# Altium project ArduinoMegaDevBoard.PrjPcb
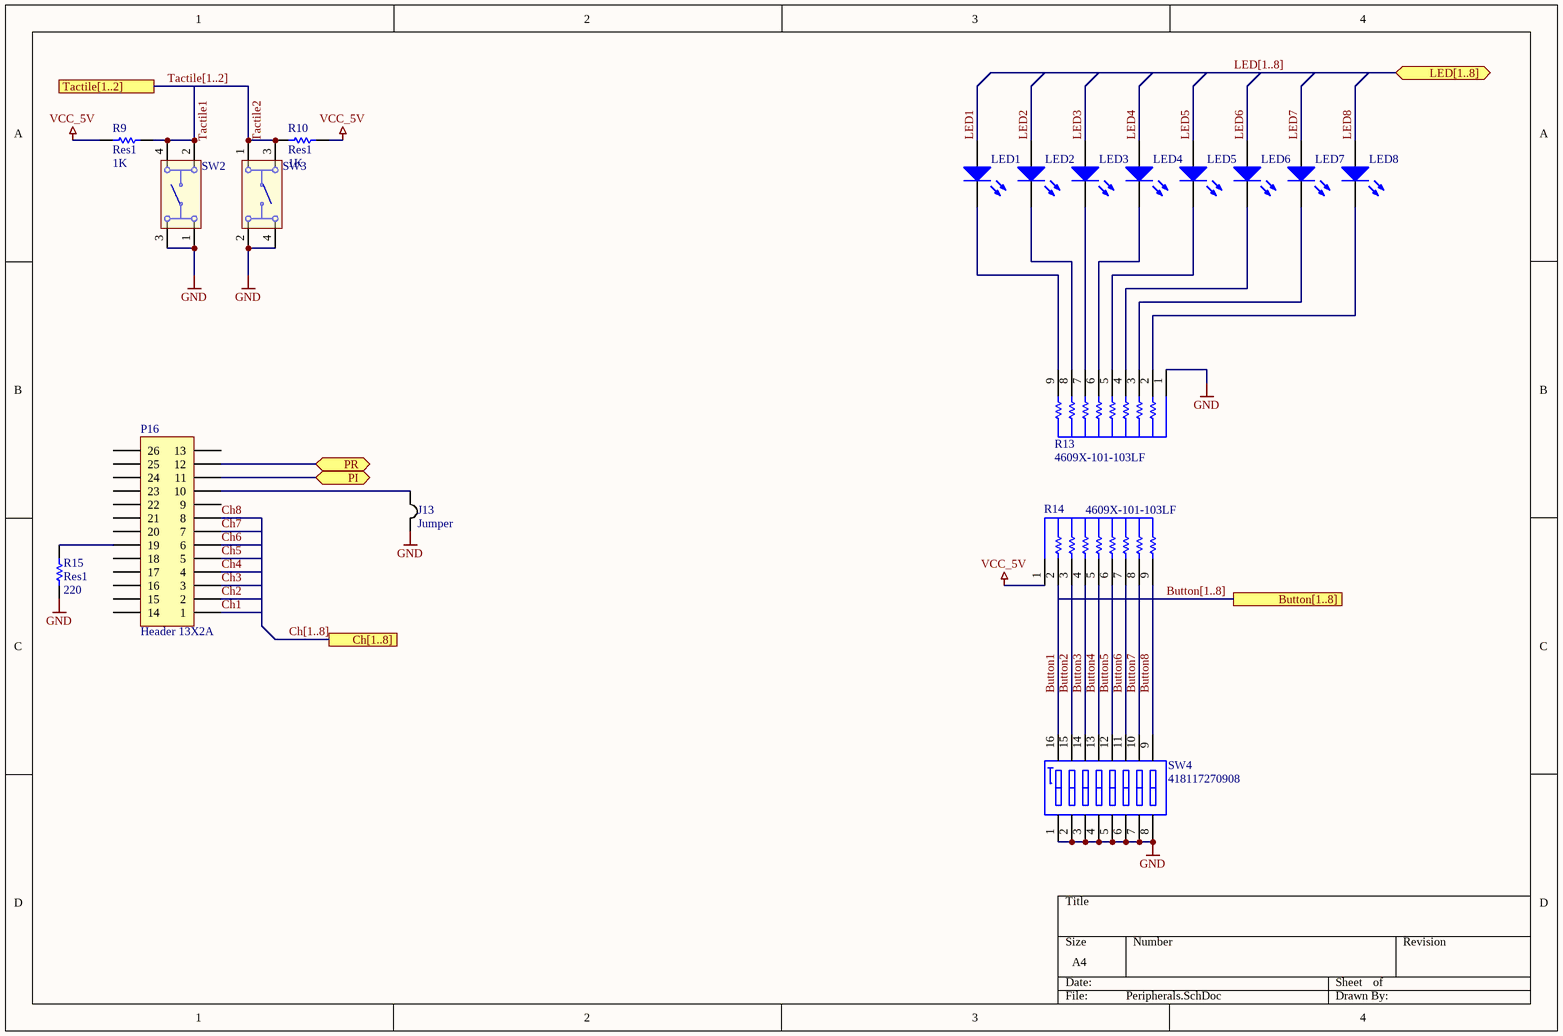
[diagram p0: Peripherals.SchDoc]
3 sheets, 20 parts. Net scope: flat (ports and power ports of the same name join across sheets).
Board file: Eurocard VME 3U (3.937 x 6.299 inches).PCBDOC
Sheets:
  Peripherals.SchDoc
  Ports.SchDoc
  Eurocard VME 3U (3.937 x 6.299 inches).schdoc

## Sheet Peripherals.SchDoc
size A4

### Parts
J13  Jumper  [SMDJumper]
LED1  TX1  [Type 3mm]  (value not drawn)
LED2  TX1  [Type 3mm]  (value not drawn)
LED3  TX1  [Type 3mm]  (value not drawn)
LED4  TX1  [Type 3mm]  (value not drawn)
LED5  TX1  [Type 3mm]  (value not drawn)
LED6  TX1  [Type 3mm]  (value not drawn)
LED7  TX1  [Type 3mm]  (value not drawn)
LED8  TX1  [Type 3mm]  (value not drawn)
P16  Header 13X2A  [HDR2X13_CEN]
R9  Res1  value 1K  [AXIAL-0.3]
R10  Res1  value 1K  [AXIAL-0.3]
R13  4609X-101-103LF  [BOUR-4609X]
R14  4609X-101-103LF  [BOUR-4609X]
R15  Res1  value 220  [AXIAL-0.3]
SW2  430156130726  [430156130726]  (value not drawn)
SW3  430156130726  [430156130726]  (value not drawn)
SW4  418117270908  [418117270908]

### Ports
Button[1..8], Ch[1..8], LED[1..8] (bidir), PI (bidir), PR (bidir), Tactile[1..2]

### Nets
GND: J13.2 R13.1 R15.1 SW2.1 SW2.3 SW3.2 SW3.4 SW4.1 SW4.2 SW4.3 SW4.4 SW4.5 SW4.6 SW4.7 SW4.8
VCC_5V: R9.1 R10.2 R14.1
Button1: R14.2 SW4.16
Button2: R14.3 SW4.15
Button3: R14.4 SW4.14
Button4: R14.5 SW4.13
Button5: R14.6 SW4.12
Button6: R14.7 SW4.11
Button7: R14.8 SW4.10
Button8: R14.9 SW4.9
Ch1: P16.1
Ch2: P16.2
Ch3: P16.3
Ch4: P16.4
Ch5: P16.5
Ch6: P16.6
Ch7: P16.7
Ch8: P16.8
LED1: LED1.2(A)
LED2: LED2.2(A)
LED3: LED3.2(A)
LED4: LED4.2(A)
LED5: LED5.2(A)
LED6: LED6.2(A)
LED7: LED7.2(A)
LED8: LED8.2(A)
Tactile1: R9.2 SW2.2 SW2.4
Tactile2: R10.1 SW3.1 SW3.3
NetJ13_1: J13.1 P16.10
NetLED1_1: LED1.1(K) R13.9
NetLED2_1: LED2.1(K) R13.8
NetLED3_1: LED3.1(K) R13.7
NetLED4_1: LED4.1(K) R13.6
NetLED5_1: LED5.1(K) R13.5
NetLED6_1: LED6.1(K) R13.4
NetLED7_1: LED7.1(K) R13.3
NetLED8_1: LED8.1(K) R13.2
NetP16_11: P16.11 ; port PI
NetP16_12: P16.12 ; port PR
NetP16_19: P16.19 R15.2

Not connected (* = marked no-connect by the designer): P16 9 13 14 15 16 17 18 20 21 22 23 24 25 26

### Buses and harness runs
bus Button[1..8] = port Button[1..8]
bus Ch[1..8] = port Ch[1..8]
bus LED[1..8] = port LED[1..8]
bus Tactile[1..2] = port Tactile[1..2]

### Library data of the parts
LED1-LED8 = CMP-1489-00003-1: THT LED round mono-color waterclear, WL-TMRW, Yellow; Manufacturer: Wuerth Elektronik; PartNumber: 151033YS03000; ComponentLink2Description: Datasheet; ComponentLink1Description: Manufacturer URL; Emitting color: Yellow; ComponentLink2URL: http://katalog.we-online.de/pbs/datasheet/7448042001.pdfhttp://katalog.we-online.de/pbs/datasheet/7448042001.pdfhttp://katalog.we-online.de/pbs/datasheet/7448042001.pdfhttp://katalog.we-online.de/pbs/datasheet/151033YS03000.pdf; ComponentLink1URL: http://www.we-online.com; PackageReference: Type 3mm
P16 = Header 13X2A: Header, 13-Pin, Dual row; LatestRevisionDate: 17-Jul-2002; LatestRevisionNote: Re-released for DXP Platform.; Publisher: Altium Limited
R9 R10 R15 = Res1: Resistor; Published: 8-Jun-2000; LatestRevisionDate: 17-Jul-2002; LatestRevisionNote: Re-released for DXP Platform.; PackageReference: AXIAL-0.3; Publisher: Altium Limited; PackageDescription: Axial Device, Thru-Hole; 2 Leads; 0.3 in Pin Spacing
R13 R14 = CMP-2000-05605-1: Resistor, Network, 1.13 W, 10 kOhm, -55 to 125 degC, 9-Pin THD, RoHS, Bulk; Manufacturer: Bourns; Tolerance: ±2%; Power, Rating: 1.13W; Resistance: 10kilohms; Temperature, Operating: -55to+125°C; Brand/Series: 4600XSeries; Circuit: BussedArray; Number of Resistors: 8; Package Type: SIP; Dimensions: 0.898x0.098x0.2(22.81x2.49x5.08)LxWxHin.(mm); Package Reference: 4609X; Mounting Technology: ThroughHole; Package Description: 9-Pin Through Hole Device, Body 22.81 x 2.49 mm, Pitch 2.54 mm; Number of Terminals: 9; Datasheet URL: https://datasheet.ciiva.com/11807/0900766b8069ccfd-11807021.pdf; Datasheet Version: 04/2010; Manufacturer URL: http://www.bourns.com/; Mounting Type: ThroughHole
SW2 SW3 = CMP-1453-00009-1: WS-TATV THT Tact Switch 6X6 mm; Manufacturer: Wuerth Elektronik; NoPins: 04; PartNumber: 430156130726; ComponentLink1Description: Manufacturer URL; ComponentLink1URL: http://www.we-online.com; ComponentLink2Description: Datasheet; ComponentLink2URL: http://katalog.we-online.de/em/datasheet/4301x6.pdf; PackageReference: 430156130726
SW4 = CMP-1435-00007-1: WS-DITV 2.54 mm Compact THT Dip Switch with Raised Actuator; Manufacturer: Wuerth Elektronik; NoPins: 16; ComponentLink2URL: http://katalog.we-online.de/em/datasheet/4181172709xx.pdf; ComponentLink1Description: Manufacturer URL; ComponentLink1URL: http://www.we-online.com; ComponentLink2Description: Datasheet; PackageReference: 418117270908; PartNumber: 418117270908

## Sheet Ports.SchDoc
size A4
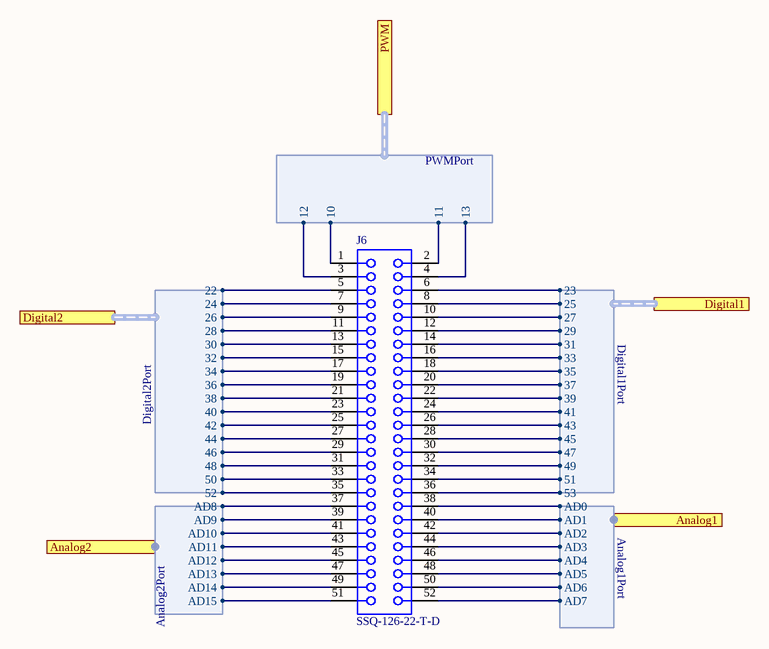
[diagram p1: Ports.SchDoc]

### Parts
J6  SSQ-126-22-T-D  [SMTC-SSQ-126-22-X-D]

### Ports
Analog1 (harness Analog1Port), Analog2 (harness Analog2Port), Digital1 (harness Digital1Port), Digital2 (harness Digital2Port), PWM (harness PWMPort)

### Harnesses
Digital2Port: 22, 24, 26, 28, 30, 32, 34, 36, 38, 40, 42, 44, 46, 48, 50, 52
Digital1Port: 23, 25, 27, 29, 31, 33, 35, 37, 39, 41, 43, 45, 47, 49, 51, 53
PWMPort: 10, 11, 12, 13
Analog1Port: AD0, AD1, AD2, AD3, AD4, AD5, AD6, AD7
Analog2Port: AD8, AD9, AD10, AD11, AD12, AD13, AD14, AD15

### Nets
NetJ6_1: J6.1 ; port PWM.10
NetJ6_2: J6.2 ; port PWM.11
NetJ6_3: J6.3 ; port PWM.12
NetJ6_4: J6.4 ; port PWM.13
NetJ6_5: J6.5 ; port Digital2.22
NetJ6_6: J6.6 ; port Digital1.23
NetJ6_7: J6.7 ; port Digital2.24
NetJ6_8: J6.8 ; port Digital1.25
NetJ6_9: J6.9 ; port Digital2.26
NetJ6_10: J6.10 ; port Digital1.27
NetJ6_11: J6.11 ; port Digital2.28
NetJ6_12: J6.12 ; port Digital1.29
NetJ6_13: J6.13 ; port Digital2.30
NetJ6_14: J6.14 ; port Digital1.31
NetJ6_15: J6.15 ; port Digital2.32
NetJ6_16: J6.16 ; port Digital1.33
NetJ6_17: J6.17 ; port Digital2.34
NetJ6_18: J6.18 ; port Digital1.35
NetJ6_19: J6.19 ; port Digital2.36
NetJ6_20: J6.20 ; port Digital1.37
NetJ6_21: J6.21 ; port Digital2.38
NetJ6_22: J6.22 ; port Digital1.39
NetJ6_23: J6.23 ; port Digital2.40
NetJ6_24: J6.24 ; port Digital1.41
NetJ6_25: J6.25 ; port Digital2.42
NetJ6_26: J6.26 ; port Digital1.43
NetJ6_27: J6.27 ; port Digital2.44
NetJ6_28: J6.28 ; port Digital1.45
NetJ6_29: J6.29 ; port Digital2.46
NetJ6_30: J6.30 ; port Digital1.47
NetJ6_31: J6.31 ; port Digital2.48
NetJ6_32: J6.32 ; port Digital1.49
NetJ6_33: J6.33 ; port Digital2.50
NetJ6_34: J6.34 ; port Digital1.51
NetJ6_35: J6.35 ; port Digital2.52
NetJ6_36: J6.36 ; port Digital1.53
NetJ6_37: J6.37 ; port Analog2.AD8
NetJ6_38: J6.38 ; port Analog1.AD0
NetJ6_39: J6.39 ; port Analog2.AD9
NetJ6_40: J6.40 ; port Analog1.AD1
NetJ6_41: J6.41 ; port Analog2.AD10
NetJ6_42: J6.42 ; port Analog1.AD2
NetJ6_43: J6.43 ; port Analog2.AD11
NetJ6_44: J6.44 ; port Analog1.AD3
NetJ6_45: J6.45 ; port Analog2.AD12
NetJ6_46: J6.46 ; port Analog1.AD4
NetJ6_47: J6.47 ; port Analog2.AD13
NetJ6_48: J6.48 ; port Analog1.AD5
NetJ6_49: J6.49 ; port Analog2.AD14
NetJ6_50: J6.50 ; port Analog1.AD6
NetJ6_51: J6.51 ; port Analog2.AD15
NetJ6_52: J6.52 ; port Analog1.AD7

### Library data of the parts
J6 = CMP-1023-00318-1: SQ Post Socket, Through-hole, Vertical, -55 to 105 degC, 2.54 mm Pitch, 52-Pin, Female, RoHS; Manufacturer: Samtec; Pitch: 2.54 mm; ComponentLink1Description: Manufacturer URL; PartNumber: SSQ-126-22-T-D; PackageDescription: Assembly, Socket Strip .025[0.64] SQ Tail; ComponentLink3Description: Package Specification; DatasheetVersion: F-214; ComponentLink2Description: Datasheet; PackageReference: SSQ-126-22-X-D; PackageVersion: BD, 6/1987; ComponentLink1URL: http://www.samtec.com; Mounting Technology: Through-hole; Orientation: Vertical; ComponentLink3URL: http://www.samtec.com/documents/webfiles/cpdf/SSQ-1XX-XX-XXX-X-XX-XXX-XX-X-MKT.pdf; Temperature Range: -55 to 105 degC; ComponentLink2URL: http://www.samtec.com/documents/webfiles/pdf/SSQ_TH.PDF; RoHS: True

## Sheet Eurocard VME 3U (3.937 x 6.299 inches).schdoc: Eurocard VME 3U (3.937 x 6.299 inches)
size A; Organization: Organization; Address1: Address1; Address2: Address2; Address3: Address3; Address4: Address4; DocumentNumber: 1; Revision: 0; SheetNumber: 2; SheetTotal: 2
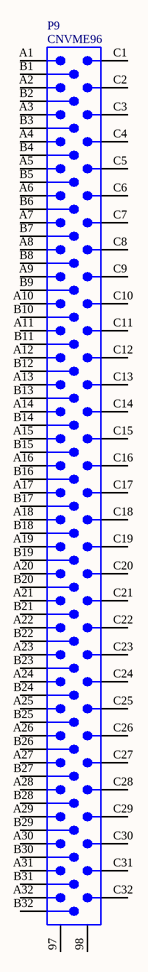
[diagram p2: Eurocard VME 3U (3.937 x 6.299 inches).schdoc]

### Parts
P9  CNVME96  [CNVME96]

### Nets

Not connected (* = marked no-connect by the designer): P9 97 98 A1 A2 A3 A4 A5 A6 A7 A8 A9 A10 A11 A12 A13 A14 A15 A16 A17 A18 A19 A20 A21 A22 A23 A24 A25 A26 A27 A28 A29 A30 A31 A32 B1 B2 B3 B4 B5 B6 B7 B8 B9 B10 B11 B12 B13 B14 B15 B16 B17 B18 B19 B20 B21 B22 B23 B24 B25 B26 B27 B28 B29 B30 B31 B32 C1 C2 C3 C4 C5 C6 C7 C8 C9 C10 C11 C12 C13 C14 C15 C16 C17 C18 C19 C20 C21 C22 C23 C24 C25 C26 C27 C28 C29 C30 C31 C32

### Library data of the parts
P9 = CNVME96: 96-Pin Connector (3x32 2.54mm grid); Text Field6: Alternate Layout Available; Text Field7: Published 14-Feb-2002